# Altium schematic sheet Discharge.SchDoc
size A4
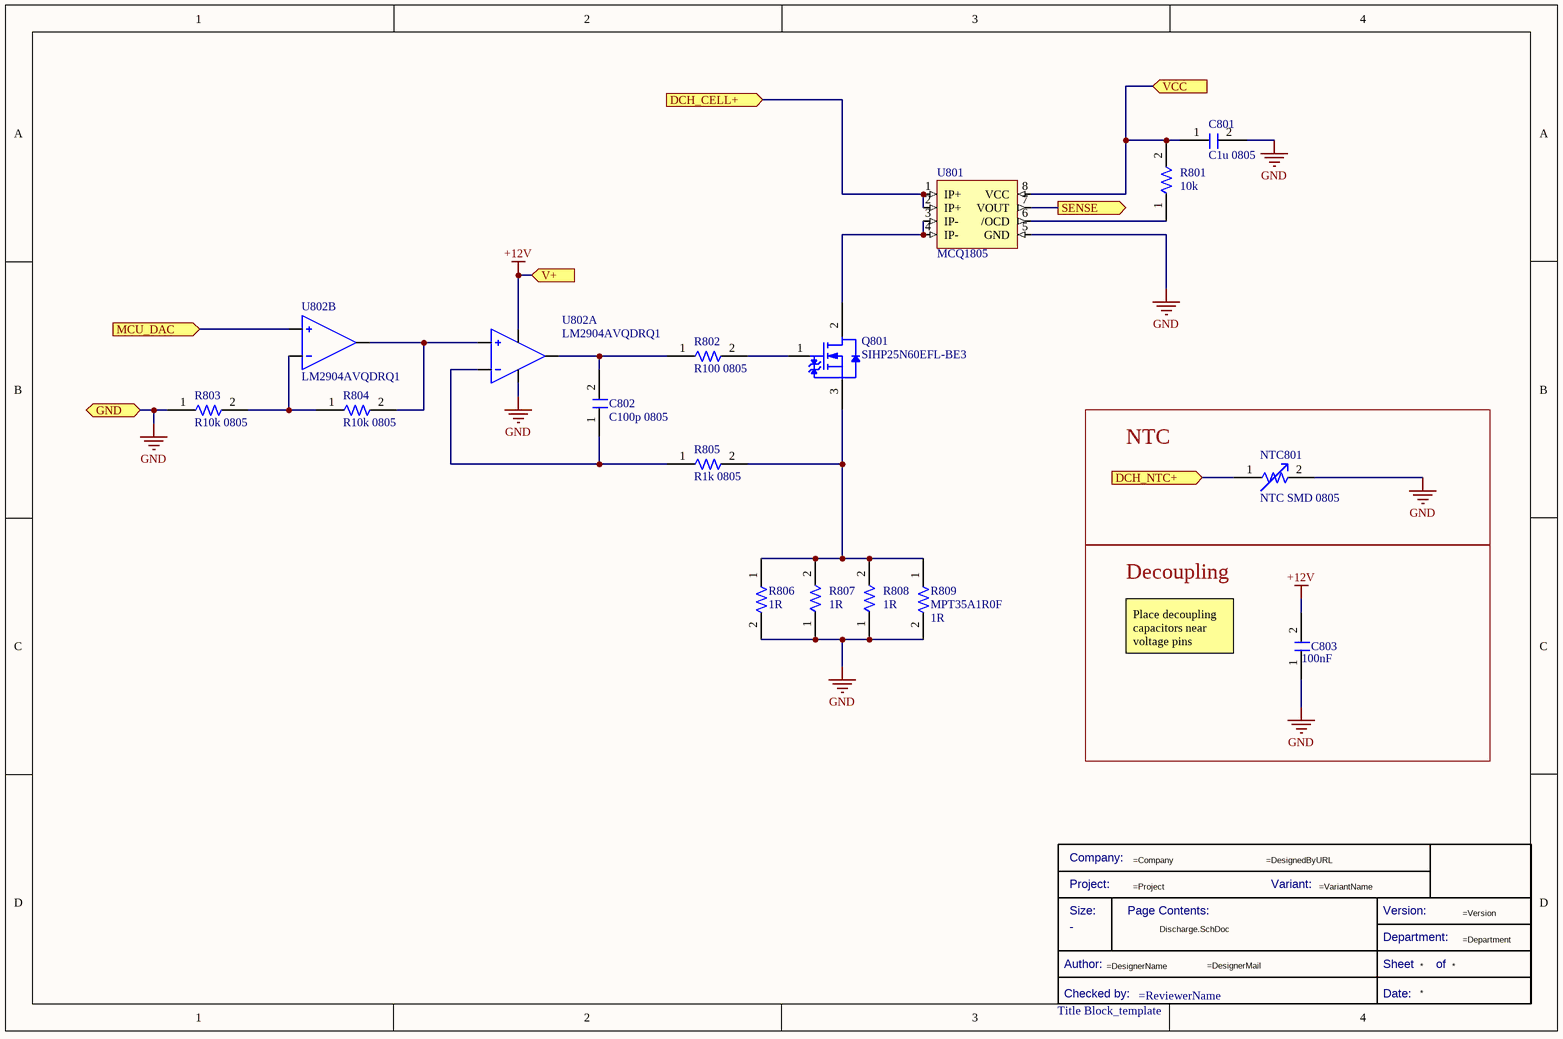
[diagram p0: Discharge.SchDoc]

## Parts
*  Title Block_template  (graphical)
C801  C1u 0805  [WCAP-CSGP_0805_L2W1.25H1.25]
C802  C100p 0805  [C0805FNPC-W]
C803  value 100nF  [C0805FNPC-R]  (hidden comment: C100n-50V-0805FNPC-X7R)
NTC801  NTC SMD 0805  [RESC2012X10N]
Q801  SIHP25N60EFL-BE3  [SIHP25N60EFL-BE3-Footprint-1]
R801  value 10k  [0805]  (hidden comment: R10k_0805_0.25W)
R802  R100 0805  [R0805FTK]
R803  R10k 0805  [R0805FTK]
R804  R10k 0805  [R0805FTK]
R805  R1k 0805  [R0805FTK]
R806  Resistance: 1R  [RTO247]  (hidden comment: MPT35A1R0F)
R807  Resistance: 1R  [RTO247]  (hidden comment: MPT35A1R0F)
R808  Resistance: 1R  [RTO247]  (hidden comment: MPT35A1R0F)
R809  MPT35A1R0F  Resistance: 1R  [RTO247]
U801  MCQ1805  [SOIC127P600X175-8N]
U802  LM2904AVQDRQ1  [SOIC127P600X175-8M]  (parts A,B of 2)

## Blocks framed on the sheet
NTC: NTC801
Decoupling: C803

## Ports
DCH_CELL+ (in), DCH_NTC+ (in), GND (bidir), MCU_DAC (in), SENSE (out), V+ (in), VCC (in)

## Nets
+12V: C803.2 U802.8(VCC+) ; port V+
GND: C801.2 C803.1 NTC801.2 R803.1 R806.2 R807.1 R808.1 R809.2 U801.5(GND) U802.4(VCC-) ; port GND
DCH_CELL+: U801.1(IP+) U801.2(IP+) ; port DCH_CELL+
DCH_NTC+: NTC801.1 ; port DCH_NTC+
MCU_DAC: U802.5(2IN+) ; port MCU_DAC
SENSE: U801.7(VOUT) ; port SENSE
VCC: C801.1 R801.2 U801.8(VCC) ; port VCC
NetC802_1: C802.1 R805.1 U802.2(1IN-)
NetC802_2: C802.2 R802.1 U802.1(1OUT)
NetQ801_1: Q801.1(G) R802.2
NetQ801_2: Q801.2(D) U801.3(IP-) U801.4(IP-)
NetQ801_3: Q801.3(S) R805.2 R806.1 R807.2 R808.2 R809.1
NetR801_1: R801.1 U801.6(/OCD)
NetR803_2: R803.2 R804.1 U802.6(2IN-)
NetR804_2: R804.2 U802.3(1IN+) U802.7(OUT2)

## Notes on the sheet
- Place decoupling capacitors near voltage pins
- (in symbol CMP-00043-7) Company:; Project:; Variant:; Size:; Page Contents:; Version:; Department:; Author:; Sheet; of; Checked by:; Date:

## Library data of the parts
* = CMP-00043-7: Standard Title Block; .Creator: GP; Checked by:: =ReviewerName; Size: -; Design Item ID: Title Block_template; Category: Title Block; .SCHcheck: GP; Source: e-Tech_Racing.SchLib; .PCBcheck: GP
C801 = CMP-001-00010-5: Ceramic Capacitor, Multilayer, Ceramic, 16V, 10% +Tol, 10% -Tol, X7R, 15% TC, 1uF, Surface Mount, 0805; Capacitor Type: Ceramic; Pins: 2; RoHS Compliant: Yes
C802 = CMP-00068-3: Multilayer Ceramic Capacitor, Wcap-Csgp Series, 100 Pf, 5%, C0G / Np0, 50 V, 0805 [2012 Metric] Rohs Compliant: Yes; Manufacturer: Wurth Electronics; Manufacturer Part Number: 885012007057; Voltage Rating: 50V; .Creator: DR; Value: 100pF; Source: Passives.SchLib; ComponentLink2URL: https://katalog.we-online.de/pbs/datasheet/885012007057.pdf?src-supplier=Digi-Key; Tolerance: 5%; ComponentLink3Description: http://www.farnell.com/datasheets/1958443.pdf?src-supplier=Element14; ComponentLink5Description: Where buy it; ComponentLink2Description: https://katalog.we-online.de/pbs/datasheet/885012007057.pdf?src-supplier=Digi-Key; Length: 0.079inch; Voltage Rating (DC): 50V; ComponentLink4Description: http://www.farnell.com/datasheets/1958443.pdf?src-supplier=Newark; Packaging: Cut Tape; Stock 1: 1; Thickness: 0.035inch; ComponentLink4URL: http://www.farnell.com/datasheets/1958443.pdf?src-supplier=Newark; RoHS Compliant: Yes; ComponentLink1URL: http://www.farnell.com/datasheets/1958443.pdf?src-supplier=Farnell; Case/Package: 0805; REACH SVHC: Unknown; RoHS: Yes; Mount: Surface Mount; Design Item ID: C100p-50V-0805FNPC-C0G/NP0; ComponentLink1Description: http://www.farnell.com/datasheets/1958443.pdf?src-supplier=Farnell; Dielectric: C0G; Min Operating Temperature: -55°C; ComponentLink3URL: http://www.farnell.com/datasheets/1958443.pdf?src-supplier=Element14; Case Code (Metric): 2012; Pricing 1: 4000=0,03900, 12000=0,03800 (USD); Max Operating Temperature: 125°C; Width: 0.049inch; ComponentLink5URL: https://www.we-online.com/catalog/en/WCAP-CSGP-50VDC#885012007057; Category: Ceramic Capacitors
C803 = CMP-00063-1: Cap, 0.1ΜF, 50V, 10%, X7R, 0805; Manufacturer 1: Wurth Electronics; Manufacturer Part Number 1: 885012207098; .Creator: DR; Pricing 1: 100=0,10200, 500=0,07100, 2000=0,06100 (GBP); ComponentLink1URL: http://www.farnell.com/datasheets/1958498.pdf?src-supplier=Farnell; Design Item ID: C100n-50V-0805FNPC-X7R; Voltage Rating (DC): 50V; Voltage Rating: 50V; Max Operating Temperature: 125°C; RoHS: Yes; Case Code (Metric): 2012; Mount: Surface Mount; REACH SVHC: Unknown; Stock 1: 8000; Source: Passives.SchLib; Tolerance: 10%; RoHS Compliant: Yes; Dielectric: X7R; ComponentLink2Description: http://www.farnell.com/datasheets/1958498.pdf?src-supplier=Element14; ComponentLink2URL: http://www.farnell.com/datasheets/1958498.pdf?src-supplier=Element14; Min Operating Temperature: -55°C; Width: 0.049inch; Category: Ceramic Capacitors; Thickness: 0.035inch; Length: 0.079inch; ComponentLink3URL: https://katalog.we-online.de/pbs/datasheet/885012207098.pdf?src-supplier=Digi-Key; Case/Package: 0805; ComponentLink3Description: https://katalog.we-online.de/pbs/datasheet/885012207098.pdf?src-supplier=Digi-Key; Packaging: Cut Tape; ComponentLink1Description: http://www.farnell.com/datasheets/1958498.pdf?src-supplier=Farnell; ComponentLink4Description: http://www.farnell.com/datasheets/1958498.pdf?src-supplier=Newark; ComponentLink4URL: http://www.farnell.com/datasheets/1958498.pdf?src-supplier=Newark
NTC801 = CMP-010-00001-1: NTC 0805 package 10kR
Q801 = CMP-013-00005-1: Power Field-Effect Transistor N Channel THT; RoHS Compliant: No
R801 = CMP-009-00035-3: Resistor, 10K, 0.25W, Thick Film, 0805 Rohs Compliant: Yes
R802 = CMP-00083-1: Res Thick Film 0805 100 Ohm 1% 1/8W ±100ppm/°C Molded SMD SMD Paper Tape on Plastic Reel; Manufacturer Part Number 1: CR0805-FX-1000ELF; Manufacturer 1: Bourns; Power Rating: 125mW; Voltage Rating (DC): 150V; .Creator: DR; Value: 100; Military Standard: Not; Radiation Hardening: No; Max Operating Temperature: 155°C; Packaging: Tape and Reel; ComponentLink3Description: https://datasheet.ciiva.com/6547/chpreztr-6547414.pdf?src-supplier=Digi-Key; RoHS Compliant: Yes; ComponentLink5Description: https://datasheet.ciiva.com/9120/chpreztr-9120744.pdf?src-supplier=Avnet; ComponentLink4URL: https://datasheet.ciiva.com/6547/chpreztr-6547415.pdf?src-supplier=Digi-Key; REACH SVHC: No SVHC; Depth: 1.25mm; Case/Package: 0805; Series: CR0805; Pricing 1: 1=0,05840, 10=0,03430, 25=0,01780, 100=0,00750, 250=0,00560, 500=0,00490, 3000=0,00470 (USD); Features: Moisture Resistant; Design Item ID: R100-0805FTK; Resistor Type: Thick Film; ComponentLink3URL: https://datasheet.ciiva.com/6547/chpreztr-6547414.pdf?src-supplier=Digi-Key; Construction: Rectangular; Width: 1.25mm; ComponentLink4Description: https://datasheet.ciiva.com/6547/chpreztr-6547415.pdf?src-supplier=Digi-Key; Stock 1: 49802; ComponentLink1URL: https://datasheet.ciiva.com/11809/0900766b80fcdb72-11809178.pdf?src-supplier=RSComponents; Number of Terminations: 2; ComponentLink1Description: https://datasheet.ciiva.com/11809/0900766b80fcdb72-11809178.pdf?src-supplier=RSComponents; Length: 2mm; Min Operating Temperature: -55°C; Height: 0.5mm; Mount: Surface Mount; Max Power Dissipation: 125mW; Technology: THICK FILM; Case Code (Metric): 2012; Tolerance: 1%; Category: Chip SMD Resistors; Thickness: 508um; Source: Passives.SchLib; Resistance Tolerance: 1%; RoHS: Yes; ComponentLink5URL: https://datasheet.ciiva.com/9120/chpreztr-9120744.pdf?src-supplier=Avnet; Temperature Coefficient: 100ppm/°C; Package Quantity: 1; Pins: 2; Contact Plating: Tin; Voltage Rating: 150V; Termination: SMD/SMT; ComponentLink2Description: https://datasheet.ciiva.com/6547/chpreztr-6547413.pdf?src-supplier=Digi-Key; ComponentLink2URL: https://datasheet.ciiva.com/6547/chpreztr-6547413.pdf?src-supplier=Digi-Key
R803 R804 = CMP-00085-4: BOURNS         CR0805-JW-103ELF            Surface Mount Chip Resistor, Thick Film, CR Series, 10 kohm, 125 mW,  5%, 150 V; Voltage Rating: 150V; Voltage Rating (DC): 100V; Max Power Dissipation: 125mW; Temperature Coefficient: 200ppm/°C; Value: 10k; .Creator: DR; Depth: 1.25mm; Package Quantity: 1; ComponentLink6Description: https://datasheet.ciiva.com/16783/70154685-16783482.pdf?src-supplier=Allied+Electronics; Max Operating Temperature: 155°C; ComponentLink8Description: https://datasheet.ciiva.com/6559/chpreztr-6559900.pdf?src-supplier=Digi-Key; ComponentLink3URL: https://datasheet.ciiva.com/22693/1902866-22693254.pdf?src-supplier=Element14; ComponentLink2URL: https://datasheet.ciiva.com/9122/chpreztr-9122374.pdf?src-supplier=Avnet; REACH SVHC: No SVHC; ComponentLink9Description: https://datasheet.ciiva.com/6559/chpreztr-6559901.pdf?src-supplier=Digi-Key; ComponentLink1URL: https://datasheet.ciiva.com/11821/0900766b80fcdb72-11821135.pdf?src-supplier=RSComponents; Manufacturer Part Number 1: CR0805-JW-103ELF; ComponentLink8URL: https://datasheet.ciiva.com/6559/chpreztr-6559900.pdf?src-supplier=Digi-Key; Length: 2mm; ComponentLink10Description: https://datasheet.ciiva.com/7985/1856384-7985869.pdf?src-supplier=Element14; Case/Package: 0805; ComponentLink5Description: https://datasheet.ciiva.com/30065/159chpreztr-30065976.pdf?src-supplier=Onlinecomponents.com; Design Item ID: R10k-0805FTK; ComponentLink1Description: https://datasheet.ciiva.com/11821/0900766b80fcdb72-11821135.pdf?src-supplier=RSComponents; Number of Terminations: 2; Radiation Hardening: No; Resistance Tolerance: 5%; ComponentLink4Description: https://datasheet.ciiva.com/7986/691949-7986187.pdf?src-supplier=Element14; ComponentLink3Description: https://datasheet.ciiva.com/22693/1902866-22693254.pdf?src-supplier=Element14; Packaging: Tape and Reel; ComponentLink6URL: https://datasheet.ciiva.com/16783/70154685-16783482.pdf?src-supplier=Allied+Electronics; Pins: 2; ComponentLink5URL: https://datasheet.ciiva.com/30065/159chpreztr-30065976.pdf?src-supplier=Onlinecomponents.com; Mount: Surface Mount; ComponentLink11URL: https://datasheet.ciiva.com/48692/001055517-da-01-en-smd-wid-cr0805-jw-103elf-10k-ohm-1-8w-48692118.pdf?src-supplier=Conrad; ComponentLink11Description: https://datasheet.ciiva.com/48692/001055517-da-01-en-smd-wid-cr0805-jw-103elf-10k-ohm-1-8w-48692118.pdf?src-supplier=Conrad; Military Standard: Not; Power Rating: 125mW; Thickness: 508um; Source: Passives.SchLib; Min Operating Temperature: -55°C; Manufacturer 1: Bourns; Resistor Type: Thick Film; ComponentLink7URL: https://datasheet.ciiva.com/5548/chpreztr-5548491.pdf?src-supplier=Mouser; ComponentLink2Description: https://datasheet.ciiva.com/9122/chpreztr-9122374.pdf?src-supplier=Avnet; Termination: SMD/SMT; Features: Moisture Resistant; ComponentLink4URL: https://datasheet.ciiva.com/7986/691949-7986187.pdf?src-supplier=Element14; RoHS Compliant: Yes; ComponentLink9URL: https://datasheet.ciiva.com/6559/chpreztr-6559901.pdf?src-supplier=Digi-Key; Technology: THICK FILM; ComponentLink10URL: https://datasheet.ciiva.com/7985/1856384-7985869.pdf?src-supplier=Element14; Height: 0.5mm; Category: Chip SMD Resistors; RoHS: Yes; Series: CR0805; Pricing 1: 1=0,05790, 10=0,01540, 25=0,01340, 100=0,00340 (USD); Stock 1: 57566; ComponentLink7Description: https://datasheet.ciiva.com/5548/chpreztr-5548491.pdf?src-supplier=Mouser; Case Code (Metric): 2012; Contact Plating: Tin; Tolerance: 5%; Construction: Rectangular; Width: 1.25mm
R805 = CMP-00076-1: Res Thick Film 0805 1K Ohm 5% 1/8W ±200ppm/°C Molded SMD SMD Paper Tape on Plastic Reel; Manufacturer Part Number 1: CR0805-JW-102ELF; Manufacturer 1: Bourns; Voltage Rating (DC): 150V; Power Rating: 125mW; .Creator: GP; Number of Terminations: 2; REACH SVHC: No SVHC; ComponentLink3URL: https://datasheet.ciiva.com/22693/1902866-22693253.pdf?src-supplier=Element14; ComponentLink1URL: https://datasheet.ciiva.com/11821/0900766b80fcdb72-11821134.pdf?src-supplier=RSComponents; ComponentLink1Description: https://datasheet.ciiva.com/11821/0900766b80fcdb72-11821134.pdf?src-supplier=RSComponents; Category: Chip SMD Resistors; Stock 1: 27510; Case/Package: 0805; ComponentLink3Description: https://datasheet.ciiva.com/22693/1902866-22693253.pdf?src-supplier=Element14; Length: 2mm; ComponentLink5URL: https://datasheet.ciiva.com/7985/1856384-7985867.pdf?src-supplier=Element14; ComponentLink7Description: https://datasheet.ciiva.com/6547/chpreztr-6547359.pdf?src-supplier=Digi-Key; Package Quantity: 1; Tolerance: 5%; Lead Free: Lead Free; RoHS: Yes; Contact Plating: Tin; ComponentLink2Description: https://datasheet.ciiva.com/15225/getdatasheetpartid-78155-15225381.pdf?src-supplier=Verical; ComponentLink5Description: https://datasheet.ciiva.com/7985/1856384-7985867.pdf?src-supplier=Element14; Depth: 1.25mm; Thickness: 508um; Resistor Type: Thick Film; Design Item ID: R1k-0805FTK; ComponentLink2URL: https://datasheet.ciiva.com/15225/getdatasheetpartid-78155-15225381.pdf?src-supplier=Verical; Max Operating Temperature: 155°C; ComponentLink6URL: https://datasheet.ciiva.com/30242/159chpreztr-30242765.pdf?src-supplier=Onlinecomponents.com; ComponentLink4URL: https://datasheet.ciiva.com/7986/1856384-7986184.pdf?src-supplier=Element14; Military Standard: Not; Case Code (Metric): 2012; Temperature Coefficient: 200ppm/°C; Pricing 1: 1=0,05930, 10=0,03510, 25=0,01790, 100=0,00800, 250=0,00790, 500=0,00590, 1000=0,00360, 3000=0,00350, 6000=0,00250 (USD); Min Operating Temperature: -55°C; ComponentLink7URL: https://datasheet.ciiva.com/6547/chpreztr-6547359.pdf?src-supplier=Digi-Key; Width: 1.25mm; Source: Passives.SchLib; Max Power Dissipation: 125mW; Voltage Rating: 150V; ComponentLink4Description: https://datasheet.ciiva.com/7986/1856384-7986184.pdf?src-supplier=Element14; Features: Moisture Resistant; Mount: Surface Mount; Termination: SMD/SMT; Value: 1k; Height: 0.5mm; Radiation Hardening: No; ComponentLink6Description: https://datasheet.ciiva.com/30242/159chpreztr-30242765.pdf?src-supplier=Onlinecomponents.com; Pins: 2; Packaging: Tape and Reel
R806-R809 = CMP-00221-1: Power Resistor, Thick Film, TO220, 35 W, 1 ohm, 1 %, ±100 ppm/°C, Radial-Leaded, Copper Termination, 10.16 x 15 x 4.6 mm, Tube, 2 Termination, CGS MPT; Manufacturer: TE Connectivity; Manufacturer Part Number: MPT100C470RF; ComponentLink1URL: https://es.rs-online.com/web/p/resistencias-de-montaje-en-orificio-pasante/1955176; RoHS: No; Pricing 1: 1=16,67000, 5=15,51000, 10=14,17000, 25=12,67000, 50=11,50000 (GBP); ComponentLink2URL: https://docs.rs-online.com/e31c/A700000006565355.pdf; ComponentLink1Description: Buy; Design Item ID: R470-TO247; ComponentLink2Description: Datasheet
U801 = CMP-010-00000-4: 3kVRMS Isolated Hall-Effect Current Sensor.; ComponentLink1URL: https://www.monolithicpower.com/en/documentview/productdocument/index/version/2/document_type/Datasheet/lang/en/sku/MCS1806GS/document_id/10148/; ComponentLink1Description: Datasheet
U802 = CMP-014-00007-1: Operational Amplifier, 2 Func, 7000uV Offset-Max, BIPolar, PDSO8; Nominal Supply Voltage: 5V; Channels: 2; RoHS Compliant: Yes; Case/Package: SOP; Min Operating Temperature: -40°C; Pins: 8; Max Operating Temperature: 125°C